# EAGLE schematic 808_cowbell (EAGLE 7.1.0)
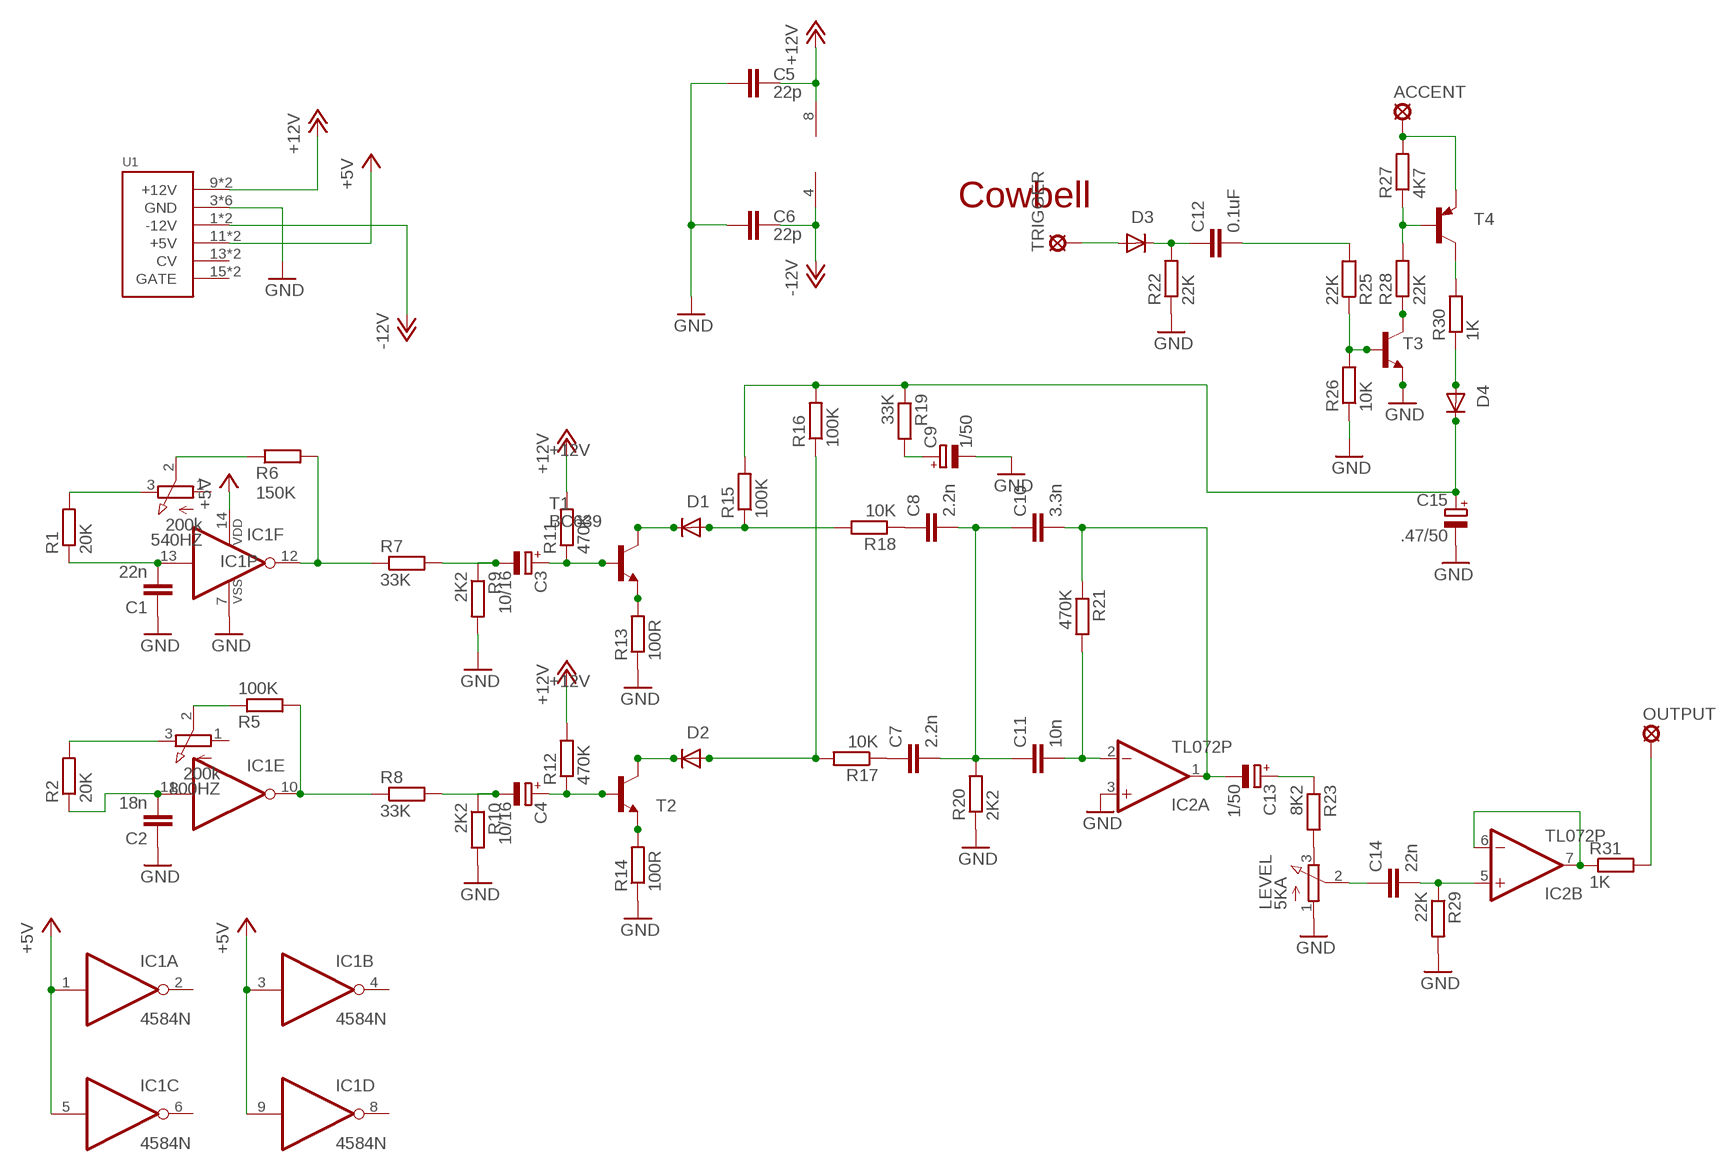
[diagram p0: schematic, sheet 1]

## Parts
540HZ  200k  3RP/1610N  [3RP/1610N]
800HZ  200k  3RP/1610N  [3RP/1610N]
ACCENT  LSP11  [LSP11]
C1  22n  C-EU4MM_PITCH  [C035-030X60]
C2  18n  C-EU4MM_PITCH  [C035-030X60]
C3  10/16  CPOL-EUE2.5-5  [E2,5-5]
C4  10/16  CPOL-EUE2.5-5  [E2,5-5]
C5  22p  C-EU025-025X050  [C025-025X050]
C6  22p  C-EU025-025X050  [C025-025X050]
C7  2.2n  C-EU3.5MM_PITCH  [C035-025X75]
C8  2.2n  C-EU3.5MM_PITCH  [C035-025X75]
C9  1/50  CPOL-EUE2.5-5  [E2,5-5]
C10  3.3n  C-EU3.5MM_PITCH  [C035-025X75]
C11  10n  C-EU3.5MM_PITCH  [C035-025X75]
C12  0.1uF  C-EU3.5MM_PITCH  [C035-025X75]
C13  1/50  CPOL-EUE2.5-5  [E2,5-5]
C14  22n  C-EU4MM_PITCH  [C035-030X60]
C15  .47/50  CPOL-EUE2.5-5  [E2,5-5]
D1  1N4148DO35-7  [DO35-7]
D2  1N4148DO35-7  [DO35-7]
D3  1N4148DO35-7  [DO35-7]
D4  1N4148DO35-7  [DO35-7]
IC1  4584N  [DIL14]
IC2  TL072P  [DIL08]
LEVEL  5KA  3RP/1610N  [3RP/1610N]
OUTPUT  LSP11  [LSP11]
R1  20K  R-EU_0207/5V  [0207/5V]
R2  20K  R-EU_0207/5V  [0207/5V]
R5  100K  R-EU_0207/5V  [0207/5V]
R6  150K  R-EU_0207/5V  [0207/5V]
R7  33K  R-EU_0207/5V  [0207/5V]
R8  33K  R-EU_0207/5V  [0207/5V]
R9  2K2  R-EU_0207/5V  [0207/5V]
R10  2K2  R-EU_0207/5V  [0207/5V]
R11  470K  R-EU_0207/5V  [0207/5V]
R12  470K  R-EU_0207/5V  [0207/5V]
R13  100R  R-EU_0207/5V  [0207/5V]
R14  100R  R-EU_0207/5V  [0207/5V]
R15  100K  R-EU_0207/5V  [0207/5V]
R16  100K  R-EU_0207/5V  [0207/5V]
R17  10K  R-EU_0207/7  [0207/7]
R18  10K  R-EU_0207/5V  [0207/5V]
R19  33K  R-EU_0207/5V  [0207/5V]
R20  2K2  R-EU_0207/5V  [0207/5V]
R21  470K  R-EU_0207/5V  [0207/5V]
R22  22K  R-EU_0207/5V  [0207/5V]
R23  8K2  R-EU_0207/5V  [0207/5V]
R25  22K  R-EU_0207/5V  [0207/5V]
R26  10K  R-EU_0207/5V  [0207/5V]
R27  4K7  R-EU_0207/5V  [0207/5V]
R28  22K  R-EU_0207/5V  [0207/5V]
R29  22K  R-EU_0207/5V  [0207/5V]
R30  1K  R-EU_0207/5V  [0207/5V]
R31  1K  R-EU_0207/5V  [0207/5V]
T1  BC639  BC639-NPN-TO92-ECB  [TO92-ECB]
T2  BC639  BC639-NPN-TO92-ECB  [TO92-ECB]
T3  BC639  BC639-NPN-TO92-ECB  [TO92-ECB]
T4  BC640  BC640-PNP-TO92-BCE  [TO92-BCE]
TRIGGER  LSP11  [LSP11]
U1  POWER  [POWER_16]

## Nets
+5V: IC1.1(A:I) IC1.3(B:I) IC1.5(C:I) IC1.9(D:I) IC1.14(P:VDD) U1.11(+5V) U1.12(+5V)
+12V [Power]: C5.2 IC2.8(P:V+) R11.2 R12.2 U1.9(+12V) U1.10(+12V)
-12V: C6.2 IC2.4(P:V-) U1.1(-12V) U1.2(-12V)
CB_OUT: OUTPUT.MP R31.2
GND [GND]: C1.P$1 C2.P$1 C5.1 C6.1 C9.- C15.- IC1.7(P:VSS) IC2.3(A:+IN) LEVEL.1(A) R9.2 R10.2 R13.1 R14.1 R20.1 R22.1 R26.1 R29.2 T3.E U1.3(GND) U1.4(GND) U1.5(GND) U1.6(GND) U1.7(GND) U1.8(GND)
N$1: C2.P$2 IC1.11(E:I) R2.1
N$2: C1.P$2 IC1.13(F:I) R1.1
N$3: 800HZ.2(S) R5.1
N$4: 540HZ.2(S) R6.1
N$5: IC1.12(F:O) R6.2 R7.1
N$6: 540HZ.3(E) R1.2
N$7: 800HZ.3(E) R2.2
N$24: C12.P$1 D3.C R22.2
N$25: C12.P$2 R25.2
N$26: D3.A TRIGGER.MP
N$441: R27.1 R28.2 T4.B
N$442: R28.1 T3.C
N$443: R25.1 R26.2 T3.B
N$444: C15.+ D4.C R15.2 R16.2 R19.1
N$445: R13.2 T1.E
N$446: C3.+ R11.1 T1.B
N$447: D1.C T1.C
N$448: D1.A R15.1 R18.2
N$449: R14.2 T2.E
N$450: C4.+ R12.1 T2.B
N$451: D2.C T2.C
N$452: D2.A R16.1 R17.2
N$453: C8.P$1 R18.1
N$454: C7.P$1 R17.1
N$455: C7.P$2 C8.P$2 C10.P$1 C11.P$1 R20.2
N$456: C10.P$2 C13.- IC2.1(A:OUT) R21.1
N$457: C11.P$2 IC2.2(A:-IN) R21.2
N$458: IC2.6(B:-IN) IC2.7(B:OUT) R31.1
N$459: C14.P$2 IC2.5(B:+IN) R29.1
N$460: C14.P$1 LEVEL.2(S)
N$461: LEVEL.3(E) R23.2
N$462: C13.+ R23.1
N$464: C3.- R7.2 R9.1
N$465: C4.- R8.2 R10.1
N$466: C9.+ R19.2
N$467: R30.2 T4.C
N$468: D4.A R30.1
TP7: IC1.10(E:O) R5.2 R8.1
TRIG*: ACCENT.MP R27.2 T4.E
Unconnected: 540HZ.1(A) 800HZ.1(A) IC1.2(A:O) IC1.4(B:O) IC1.6(C:O) IC1.8(D:O) U1.13(CV) U1.14(CV) U1.15(GATE) U1.16(GATE)

## Notes on the sheet
- Cowbell

## Library data of the parts
540HZ 800HZ LEVEL = pot:3RP/1610N: 16mm Potentiometer one level Source: http://www.alphapotentiometers.net/html/16mm_pot_2.html
ACCENT OUTPUT TRIGGER = solpad:LSP11: SOLDER PAD drill 1.1 mm
C1 C2 C5-C8 C10-C12 C14 = TR808clone:C-EU: CAPACITOR, European symbol Pitch 3mm
C3 C4 C9 C13 C15 = TR808clone:CPOL-EU: POLARIZED CAPACITOR, European symbol
D1-D4 = TR808clone:1N4148: DIODE high speed (Philips)
IC1 = TR808clone:4584: Hex SCHMITT TRIGGER (74C14)
IC2 = linear:TL072: OP AMP
R1 R2 R5-R23 R25-R31 = TR808clone:R-EU_: RESISTOR, European symbol
T1-T3 = transistor:*-NPN-: NPN Transistror BF959 corrected 2008.03.06
T4 = transistor:*-PNP-: PNP Transistror
U1 = eurorack:POWER

## Net classes
0 default: width 0.635 mm, drill 0.254 mm, clearance 0.254 mm
1 GND: width 1.016 mm, drill 1.016 mm, clearance 0.508 mm
2 Power: width 1.016 mm, drill 1.016 mm, clearance 0.508 mm
3 special: width 0.635 mm, drill 0.254 mm, clearance 0.254 mm
4 15v: width 1.524 mm, drill 1.016 mm, clearance 0.508 mm